# EAGLE design Logic Module - Power V8 (EAGLE 9.3.1)
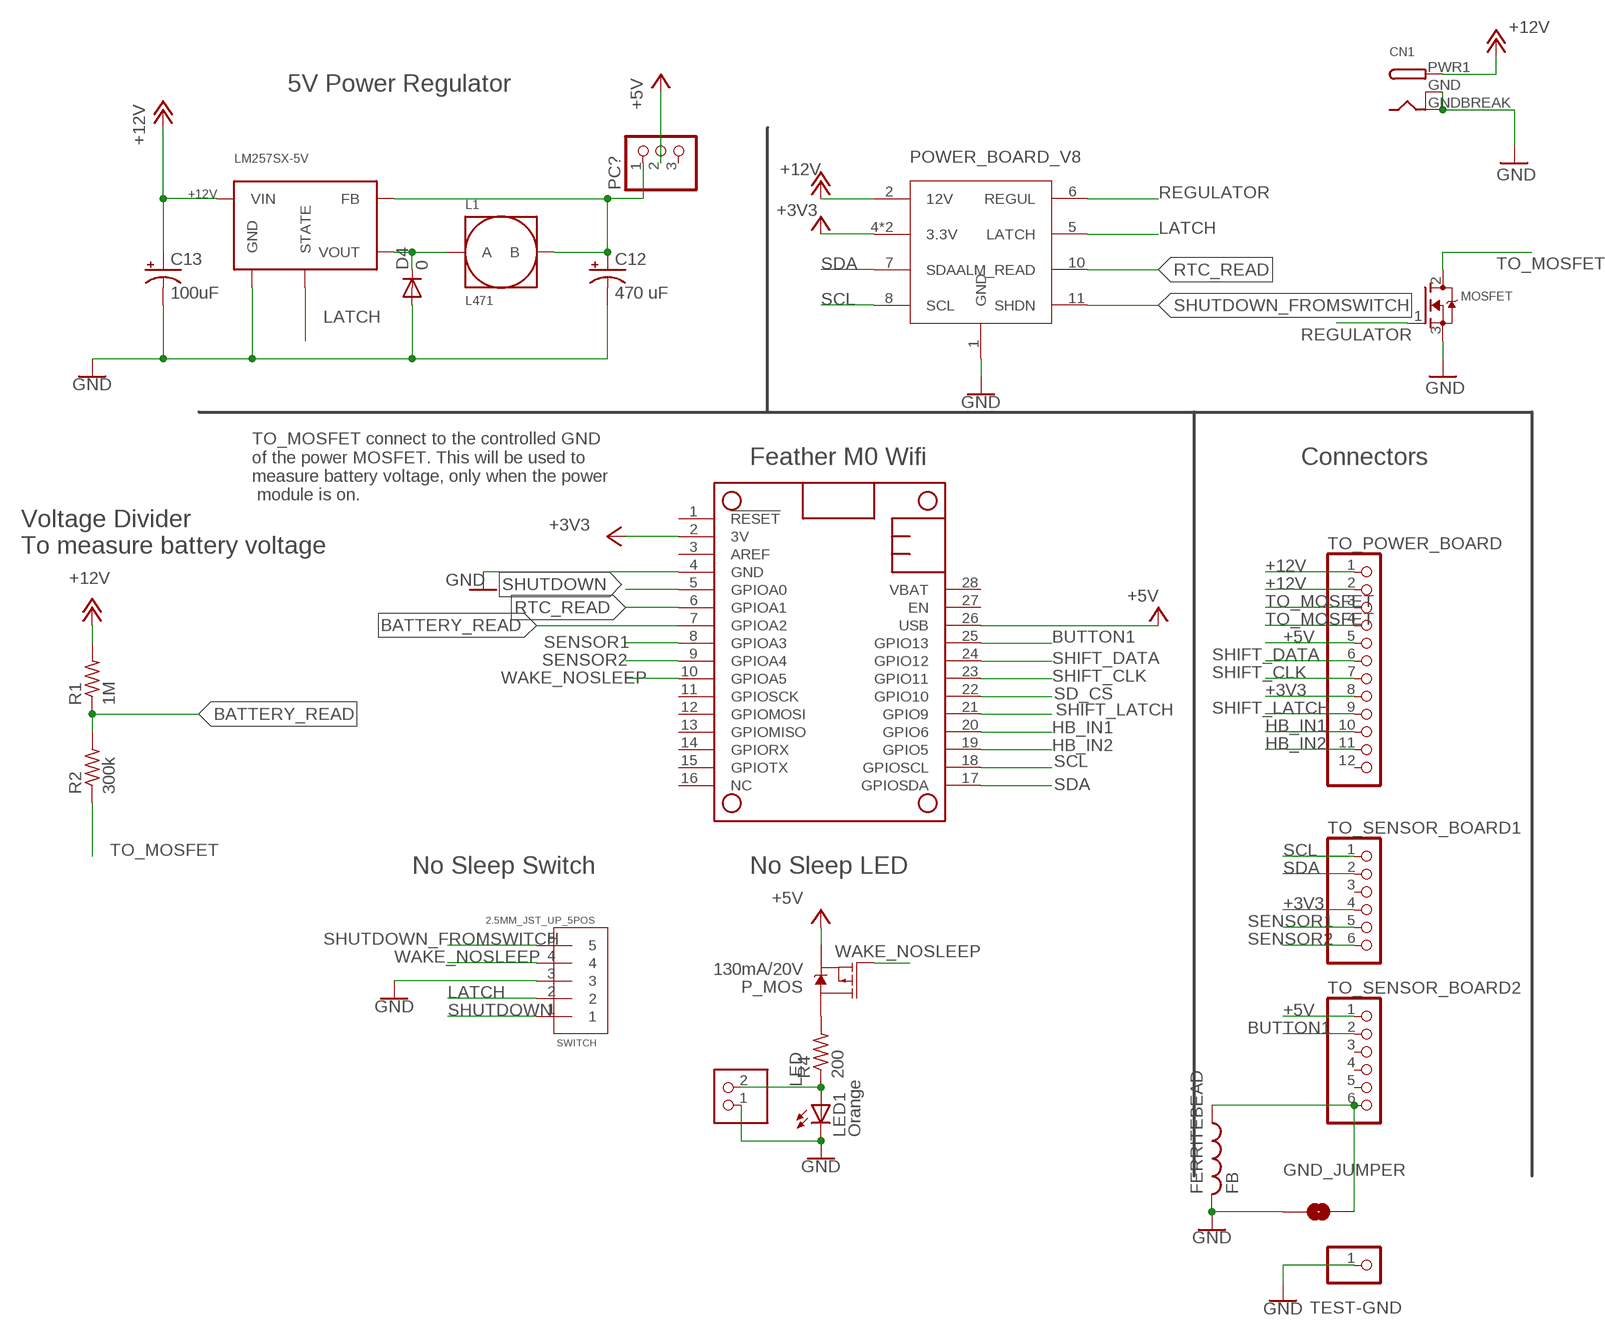
[diagram p0: schematic, sheet 1]

## Parts
C12  470 uF  CPOL-US153CLV-0810  [153CLV-0810]
C13  100uF  CPOL-US153CLV-0605  [153CLV-0605]
CN1  DCBARRELSMT  [DCJACK_2MM_SMT]
D4  0  1N4004  [DO41-10]
FERRITEBEAD  FB  [FB]
GND_JUMPER  JUMPER-SMT_2_NO_NO-SILK  [SMT-JUMPER_2_NO_NO-SILK]
L1  L471  [12-12]
LED  2.5MM_JST_UP_2POS  [JST_2POS_2.5MM_UP]
LED1  Orange  LED3MM  [LED3MM]
LM257SX-5V  LM2575  [TO-263]
MOSFET  MOSFET-NGDS_TO220V  [TO220V]
MS1  FEATHERWING  [FEATHERWING]
P_MOS  130mA/20V  MOSFET_PCH-IRLML2244  [SOT23-3]
PC?  PINHD-1X3  [1X03]
POWER_BOARD_V8  OPENS_POWER_8  [OPEN_POWER_8]
R1  1M  R-US_R1206  [R1206]
R2  300k  R-US_R1206  [R1206]
R4  200  R-US_0204/7  [0204/7]
SWITCH  2.5MM_JST_UP_5POS  [JST_5POS_2.5MM_UP]
TEST-GND  PINHD-1X1  [1X01]
TO_POWER_BOARD  PINHD-1X12  [1X12]
TO_SENSOR_BOARD1  PINHD-1X6CB  [1X06-CLEANBIG]
TO_SENSOR_BOARD2  PINHD-1X6CB  [1X06-CLEANBIG]

## Nets
5_RAW [5v]: C12.+ L1.B LM257SX-5V.FB PC?.1
+3V3: MS1.2(3V) POWER_BOARD_V8.4(3.3V) POWER_BOARD_V8.9(3.3V) TO_POWER_BOARD.8 TO_SENSOR_BOARD1.4
+5V [12v]: MS1.26(USB) P_MOS.2(S) PC?.2 TO_POWER_BOARD.5 TO_SENSOR_BOARD2.1
+12V [12v]: C13.+ CN1.PWR1(PWR) LM257SX-5V.VIN POWER_BOARD_V8.2(12V) R1.2 TO_POWER_BOARD.1 TO_POWER_BOARD.2
BATTERY_READ: MS1.7(GPIOA2) R1.1 R2.2
BUTTON1: MS1.25(GPIO13) TO_SENSOR_BOARD2.2
GND: C12.- C13.- CN1.GND(GNDBREAK) CN1.GNDBREAK(GND) D4.A FERRITEBEAD.P$2 GND_JUMPER.1 LED1.K(C) LED.1 LM257SX-5V.GND MOSFET.3(S) MS1.4(GND) POWER_BOARD_V8.1(GND) SWITCH.3 TEST-GND.1
HB_IN1: MS1.20(GPIO6) TO_POWER_BOARD.10
HB_IN2: MS1.19(GPIO5) TO_POWER_BOARD.11
LATCH: LM257SX-5V.STATE POWER_BOARD_V8.5(LATCH) SWITCH.2
N$2: P_MOS.3(D) R4.2
N$3: LED1.A LED.2 R4.1
N$6: FERRITEBEAD.P$1 GND_JUMPER.2 TO_SENSOR_BOARD2.6
N$8 [5v]: D4.C L1.A LM257SX-5V.VOUT
REGULATOR: MOSFET.1(G) POWER_BOARD_V8.6(REGUL)
RTC_READ: MS1.6(GPIOA1) POWER_BOARD_V8.10(ALM_READ)
SCL: MS1.18(GPIOSCL) POWER_BOARD_V8.8(SCL) TO_SENSOR_BOARD1.1
SD_CS: MS1.22(GPIO10)
SDA: MS1.17(GPIOSDA) POWER_BOARD_V8.7(SDA) TO_SENSOR_BOARD1.2
SENSOR1: MS1.8(GPIOA3) TO_SENSOR_BOARD1.5
SENSOR2: MS1.9(GPIOA4) TO_SENSOR_BOARD1.6
SHIFT_CLK: MS1.23(GPIO11) TO_POWER_BOARD.7
SHIFT_DATA: MS1.24(GPIO12) TO_POWER_BOARD.6
SHIFT_LATCH: MS1.21(GPIO9) TO_POWER_BOARD.9
SHUTDOWN: MS1.5(GPIOA0) SWITCH.1
SHUTDOWN_FROMSWITCH: POWER_BOARD_V8.11(SHDN) SWITCH.5
TO_MOSFET: MOSFET.2(D) R2.1 TO_POWER_BOARD.3 TO_POWER_BOARD.4
WAKE_NOSLEEP: MS1.10(GPIOA5) P_MOS.1(G) SWITCH.4
Unconnected: MS1.1(!RESET) MS1.3(AREF) MS1.11(GPIOSCK) MS1.12(GPIOMOSI) MS1.13(GPIOMISO) MS1.14(GPIORX) MS1.15(GPIOTX) MS1.16(NC) MS1.27(EN) MS1.28(VBAT) PC?.3 TO_POWER_BOARD.12 TO_SENSOR_BOARD1.3 TO_SENSOR_BOARD2.3 TO_SENSOR_BOARD2.4 TO_SENSOR_BOARD2.5

## Notes on the sheet
- 5V Power Regulator
- Feather M0 Wifi | Connectors
- TO_MOSFET connect to the controlled GND 
  of the power MOSFET. This will be used to
  measure battery voltage, only when the power
   module is on.
- Voltage Divider
  To measure battery voltage
- No Sleep Switch | No Sleep LED

## Library data of the parts
C12 C13 = rcl:CPOL-US: POLARIZED CAPACITOR, American symbol; SPICEPREFIX: C
CN1 = adafruit:DCBARREL: 2.0mm DC Barrel Jack DCJACK_2MM_PTH - Through Hole Jack (4UConnector: 05537)
D4 = adafruit:1N4004: DIODE General purpose 1N400x type rectifier (With bigger pads) http://www.ladyada.net/library/pcb/eaglelibrary.html
FERRITEBEAD = adafruit:FB: Ferrite bead Digikey #P9821BK-ND
GND_JUMPER = SparkFun-Jumpers:JUMPER-SMT_2_NO: Normally open jumper This jumper has two pads in close proximity to each other. Apply solder to close the connection. Round pads are easier to solder for beginners, but are a lot larger. SparkFun Product that uses the round pads: SparkFun EL Sequencer <https://www.sparkfun.com/products/12781>
L1 = LM2575:L471
LED = eDNA:2.5MM_JST_UP_2POS
LED1 = adafruit:LED: LED OSRAM: - CHIPLED LG R971, LG N971, LY N971, LG Q971, LY Q971, LO R971, LY R971 LH N974, LH R974 LS Q976, LO Q976, LY Q976 LO Q996 - Hyper CHIPLED LW Q18S LB Q993, LB Q99A, LB R99A - SideLED LS A670, LO A670, LY A670, LG A670, LP A670 LB A673, LV A673, LT A673, LW A673 LH A674 LY A675 LS A676, LA A676, LO A676, LY A676, LW A676 LS A679, LY A679, LG A679 - Hyper Micro SIDELED® LS Y876, LA Y876, LO Y876, LY Y876 LT Y87S - SmartLED LW L88C, LW L88S LB L89C, LB L89S, LG L890 LS L89K, LO L89K, LY L89K LS L896, LA L896, LO L896, LY L896 - TOPLED LS T670, LO T670, LY T670, LG T670, LP T670 LSG T670, LSP T670, LSY T670, LOP T670, LYG T670 LG T671, LOG T671, LSG T671 LB T673, LV T673, LT T673, LW T673 LH T674 LS T676, LA T676, LO T676, LY T676, LB T676, LH T676, LSB T676, LW T676 LB T67C, LV T67C, LT T67C, LS T67K, LO T67K, LY T67K, LW E67C LS E67B, LA E67B, LO E67B, LY E67B, LB E67C, LV E67C, LT E67C LW T67C LS T679, LY T679, LG T679 LS T770, LO T770, LY T770, LG T770, LP T770 LB T773, LV T773, LT T773, LW T773 LH T774 LS E675, LA E675, LY E675, LS T675 LS T776, LA T776, LO T776, LY T776, LB T776 LHGB T686 LT T68C, LB T68C - Hyper Mini TOPLED® LB M676 - Mini TOPLED Santana® LG M470 LS M47K, LO M47K, LY M47K Source: http://www.osram.convergy.de/
LM257SX-5V = LM2575:LM2575
MOSFET = adafruit:MOSFET-N: N-Channel Mosfet 2N7002E - 60V 260mA SOT23 [Digikey: 2N7002ET1GOSTR-ND] - REEL BSH103 - 30V 850mA SOT23 [Digikey: 568-5013-1-ND]
MS1 = adafruit:FEATHERWING
P_MOS = SparkFun-DiscreteSemi:MOSFET_PCH: P-channel MOSFETs Voltage controlled devices that allow control of high current outputs. SparkFun Products: SparkFun ESP32 Thing <https://www.sparkfun.com/products/13907> SparkFun ESP8266 Thing <https://www.sparkfun.com/products/13231>; PROD_ID: TRANS-11153; VALUE: 4.3A/20V/54mΩ
PC? = pinhead:PINHD-1X3: PIN HEADER
POWER_BOARD_V8 = eDNA:OPENS_POWER_8
R1 R2 R4 = adafruit:R-US_: RESISTOR, American symbol
SWITCH = eDNA:2.5MM_JST_UP_5POS: 2.5MM JST 5POS, 5 Position, up https://www.digikey.com/product-detail/en/jst-sales-america-inc/B5B-XH-A-LF-SN/455-2270-ND/1530483
TEST-GND = adafruit:PINHD-1X1: Pin header 1x1 for 0.1" spacing With round pins
TO_POWER_BOARD = adafruit:PINHD-1X12: PIN HEADER
TO_SENSOR_BOARD1 TO_SENSOR_BOARD2 = adafruit:PINHD-1X6: PIN HEADER

## Net classes
0 default: clearance 0.2 mm
1 12v: width 0.61 mm, clearance 0.356 mm
2 5v: width 0.406 mm, clearance 0.305 mm
3 sig: width 0.152 mm, clearance 0.152 mm

## Board
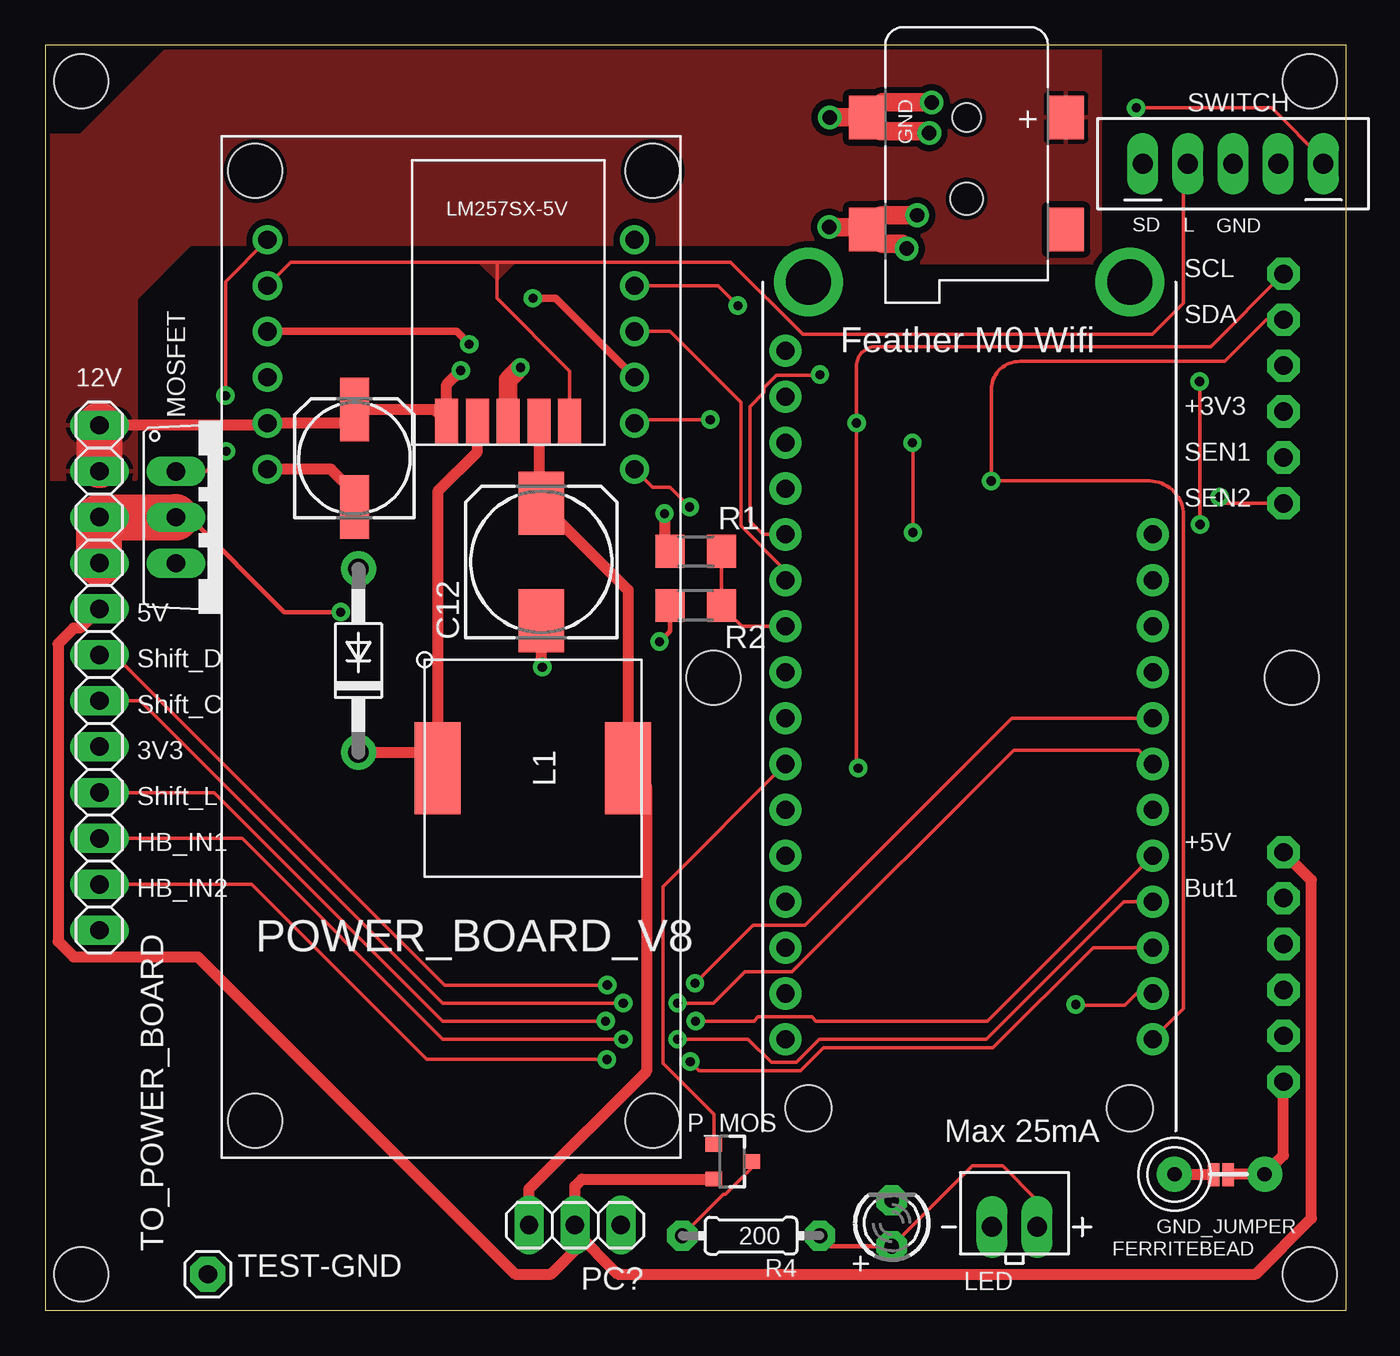
[diagram p1: board, top side]
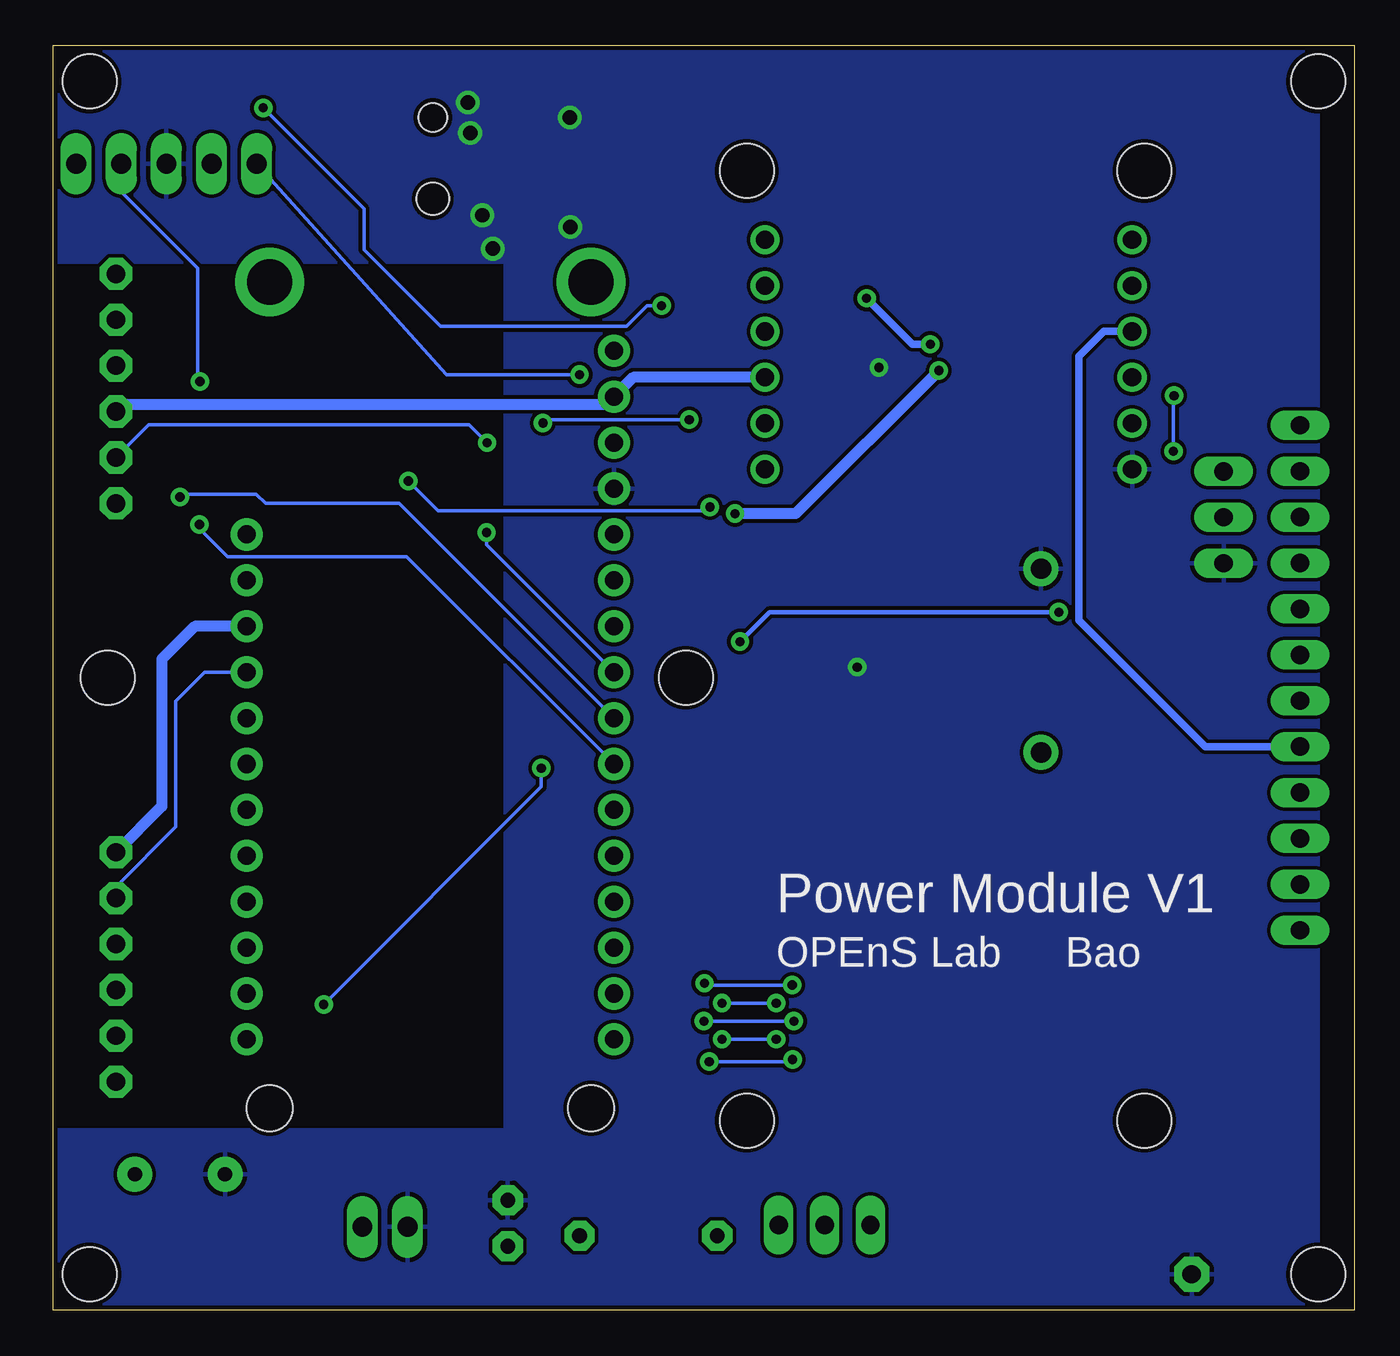
[diagram p2: board, bottom side, seen from below]

Size 72 x 70 mm. Coordinates in mm from the lower left corner, seen from the top.
Outline: 0,0 72,0 72,70 0,70 0,0
Copper layers (1*16): Top 0.035mm / dielectric 1.5mm / Bottom 0.035mm
Design rules "SparkFun": minimum track width 8mil, minimum drill 20mil, track to track 8mil, track to pad 8mil, pad to pad 8mil, via to via 8mil, smd to smd 8mil, copper to edge 10mil, drill to drill 8mil, minimum pad ring 12mil, minimum via ring 10mil, stop-mask expansion 4mil, vias tented up to drill 25mil, thermal gap 10mil
Holes 3 mm at 37,35 69,35 2,68 2,2 70,68 70,2

### Footprints (pad centres in the part's own frame; a part is rotated, then mirrored left to right if it is on the bottom)
153CLV-0810 = smd 3.5 x 2.5: + 3.25,0; - -3.25,0
153CLV-0605 = smd 3.5 x 1.6: + 2.7,0; - -2.7,0
DCJACK_2MM_SMT = smd 2.4 x 2: GND 0,-5.5; GNDBREAK 6.2,-5.5; PWR1 0,5.5; PWR2 6.2,5.5 | hole 1.6: 0,0 | hole 1.8: 4.5,0
DO41-10 = drill 1.118 pad 1.93: A 5.08,0; C -5.08,0
FB = drill 0.8 pad 1.93: P$1 -2.5,0; P$2 2.5,0
SMT-JUMPER_2_NO_NO-SILK = smd 0.635 x 1.27: 1 -0.406,0; 2 0.406,0
12-12 = smd 5.08 x 2.54: A 0,-5.27; B 0,5.27
JST_2POS_2.5MM_UP = drill 1.1 long: 1 -1.25,0; 2 1.25,0
LED3MM = drill 0.813 pad 1.676 octagon: A -1.27,0; K 1.27,0
TO-263 = smd 1.27 x 2.54: FB 1.702,1.016; GND 0,1.016; STATE 3.404,1.016; VIN -3.404,1.016; VOUT -1.702,1.016
TO220V = drill 1.016 long: 1 -2.54,-2.54; 2 0,-2.54; 3 2.54,-2.54
FEATHERWING = drill 1 pad 1.778: 1 6.35,1.27; 2 8.89,1.27; 3 11.43,1.27; 4 13.97,1.27; 5 16.51,1.27; 6 19.05,1.27; 7 21.59,1.27; 8 24.13,1.27; 9 26.67,1.27; 10 29.21,1.27; 11 31.75,1.27; 12 34.29,1.27; 13 36.83,1.27; 14 39.37,1.27; 15 41.91,1.27; 16 44.45,1.27; 17 44.45,21.59; 18 41.91,21.59; 19 39.37,21.59; 20 36.83,21.59; 21 34.29,21.59; 22 31.75,21.59; 23 29.21,21.59; 24 26.67,21.59; 25 24.13,21.59; 26 21.59,21.59; 27 19.05,21.59; 28 16.51,21.59 | drill 2.5 pad 3.81: P$1 2.54,20.32; P$2 2.54,2.54 | hole 2.54: 48.26,20.32; 48.26,2.54
SOT23-3 = smd 0.8 x 0.9: 1 -0.95,-1; 2 0.95,-1; 3 0,1.1
1X03 = drill 1.016 long: 1 -2.54,0; 2 0,0; 3 2.54,0
OPEN_POWER_8 = drill 1: 1 2.54,12.7; 2 5.08,12.7; 3 7.62,12.7; 4 10.16,12.7; 5 12.7,12.7; 6 15.24,12.7; 7 2.54,-7.62; 8 5.08,-7.62; 9 7.62,-7.62; 10 10.16,-7.62; 11 12.7,-7.62; 12 15.24,-7.62 | hole 3: 19.05,13.38; 19.05,-8.62; -33.5,-8.62; -33.5,13.38
R1206 = smd 1.6 x 1.803: 1 -1.422,0; 2 1.422,0
0204/7 = drill 0.813 pad 1.676 octagon: 1 -3.81,0; 2 3.81,0
JST_5POS_2.5MM_UP = drill 1.1 long: 1 -5,0; 2 -2.5,0; 3 0,0; 4 2.5,0; 5 5,0
1X01 = drill 1.016 pad 1.93 octagon: 1 0,0
1X12 = drill 1.016 long: 1 -13.97,0; 2 -11.43,0; 3 -8.89,0; 4 -6.35,0; 5 -3.81,0; 6 -1.27,0; 7 1.27,0; 8 3.81,0; 9 6.35,0; 10 8.89,0; 11 11.43,0; 12 13.97,0
1X06-CLEANBIG = drill 1.016 pad 1.778 octagon: 1 -6.35,0; 2 -3.81,0; 3 -1.27,0; 4 1.27,0; 5 3.81,0; 6 6.35,0

### Placement (x,y rotation side)
C12  27.46,41.41 90 top
C13  17.12,47.15 90 top
CN1  51,66 270 top
D4  17.34,35.95 90 top
FERRITEBEAD  65,7.53 180 top
GND_JUMPER  65.07,7.5 0 top
L1  27,30 270 top
LED  53.65,4.62 0 top
LED1  46.86,4.82 90 top
LM257SX-5V  25.63,48.14 0 top
MOSFET  9.77,43.88 270 top
MS1  39.71,59.44 270 top
P_MOS  38.01,8.23 270 top
PC?  29.32,4.72 0 top
POWER_BOARD_V8  25,44 90 top
R1  36,42 180 top
R2  36,39 0 top
R4  39.07,4.13 180 top
SWITCH  65.75,63.44 0 top
TEST-GND  9,2 0 top
TO_POWER_BOARD  3,35 270 top
TO_SENSOR_BOARD1  68.54,51 270 top
TO_SENSOR_BOARD2  68.54,19 270 top

### Tracks (layer width: path | path; a pad name or v marks a point on that pad's centre or on a via)
5_RAW
  Top 0.61: LM257SX-5V.FB 27.33,44.79 C12.+ 32.27,39.85 L1.B 33.27,29 33.27,13.21 26.78,6.72 PC?.1
+3V3  (via drill 0.51)
  Top 0.406: POWER_BOARD_V8.4 22.76,54.16 v23.47,53.45 | v27,56 28.24,56 POWER_BOARD_V8.9
  Bottom 0.406: TO_POWER_BOARD.8 8.25,31.19 15.24,38.18 15.24,52.79 13.87,54.16 POWER_BOARD_V8.4 | v27,56 24.45,53.45 v23.47,53.45
  Bottom 0.61: POWER_BOARD_V8.9 39.91,51.62 MS1.2 41.39,50.14 68.13,50.14 TO_SENSOR_BOARD1.4
+5V
  Top 0.61: TO_POWER_BOARD.5 1.93,37.74 1.58,37.74 0.71,36.88 0.71,20.42 1.58,19.56 8.44,19.56 26,2 28,2 29.32,3.32 PC?.2 | PC?.2 29.32,4.36 31.68,2 67,2 70.09,5.09 70.09,23.8 TO_SENSOR_BOARD2.1 | PC?.2 29.32,6.87 29.71,7.26 36.99,7.26 P_MOS.2
  Bottom 0.61: MS1.26 64.18,37.85 66,36.03 66,27.89 TO_SENSOR_BOARD2.1
+12V  (via drill 0.51)
  Top 0.61: TO_POWER_BOARD.1 12.19,48.97 POWER_BOARD_V8.2 16.85,49.08 C13.+ 21.53,49.85 LM257SX-5V.VIN 22.23,51.23 v23,52 | v34.28,44.08 34.28,42.3 R1.2
  Top 2.54: TO_POWER_BOARD.1 3,46.79
  Bottom 0.61: v23,52 30.92,44.08 v34.28,44.08
  pour Top: 0,65 2,65 7,70 58.37,70 58.37,58 45,58 44,59 8,59 5,56 5,46 0,46
BATTERY_READ
  Top 0.203: R1.1 R2.2 38.57,37.85 MS1.7
BUTTON1
  Bottom 0.203: TO_SENSOR_BOARD2.2 68.54,23.45 65.24,26.75 65.24,33.7 63.63,35.31 MS1.25
GND  (via drill 0.51, 0.8)
  Top 0.61: v27.52,35.59 27.46,35.65 C12.- | C13.- 17.12,45.23 15.81,46.54 POWER_BOARD_V8.1 | GND_JUMPER.1 64.63,7.53 FERRITEBEAD.P$2
  Top 1.016: v26.31,52.17 25.63,51.49 LM257SX-5V.GND | v48.94,65.14 48.85,65.23 46.27,65.23 CN1.GND | CN1.GND 46.33,66.83 v49.07,66.83 | CN1.GND v43.44,66 v43.43,65.99 | CN1.GNDBREAK 44.92,59.8 44.78,59.94 v43.39,59.94 | CN1.GNDBREAK 46.29,60.59 v48.27,60.59 | v47.68,58.74 47.42,59 46.3,59 CN1.GNDBREAK
  pour Bottom: 2,70 2,0 72,0 72,10 47,10 47,58 72,58 72,70
HB_IN1  (via drill 0.51)
  Top 0.203: TO_POWER_BOARD.10 10.89,26.11 22,15 v32,15 | v35,15 38.91,15 40.2,13.72 41.57,13.72 42.86,15 52.1,15 59.71,22.61 MS1.20
  Bottom 0.203: v32,15 v35,15
HB_IN2  (via drill 0.51)
  Top 0.203: TO_POWER_BOARD.11 11.43,23.57 21.12,13.88 v31.09,13.88 | v35.7,13.76 36.2,13.26 41.81,13.26 43.08,14.52 52.46,14.52 58.01,20.07 MS1.19
  Bottom 0.203: v35.7,13.76 31.21,13.76 v31.09,13.88
LATCH
  Top 0.203: 25,58 13.6,58 POWER_BOARD_V8.5 | LM257SX-5V.STATE 29.03,51.97 25,56 25,58 | 25,58 37.94,58 41.94,54 61.27,54 63,55.73 63,63.19 SWITCH.2
  pour Top: 24,58 25,57 26,58
N$2
  Top 0.203: R4.2 37.55,6.42 37.65,6.42 39.11,7.88 P_MOS.3
N$3
  Top 0.203: LED1.A 51.31,8 53,8 54.9,6.1 LED.2
  Top 0.254: R4.1 43.46,3.55 LED1.A
N$6
  Top 0.61: TO_SENSOR_BOARD2.6 68.54,8.57 FERRITEBEAD.P$1 65.51,7.53 GND_JUMPER.2
N$8
  Top 0.61: LM257SX-5V.VOUT 23.89,49.12 23.89,47.47 21.73,45.31 L1.A 21.73,30.87 D4.C
REGULATOR  (via drill 0.51)
  Top 0.203: MOSFET.1 8.9,46.42 v10.01,47.53 | v9.98,50.61 9.98,56.92 POWER_BOARD_V8.6
  Bottom 0.203: v9.98,50.61 10.01,50.58 v10.01,47.53
RTC_READ
  Top 0.203: POWER_BOARD_V8.10 34.59,54.16 38.5,50.25 38.5,43.41 40.98,40.93 MS1.6
SCL  (via drill 0.51)
  Top 0.203: v36.81,49.28 32.82,49.28 POWER_BOARD_V8.8 | TO_SENSOR_BOARD1.1 64.51,53.32 45.98,53.32 arc90 44.91,52.25 v44.91,49.1 44.91,30.09 v45,30 | MS1.18 60.39,17.53 59.75,16.89 57.07,16.89 v57.04,16.92
  Bottom 0.203: v44.91,49.1 44.73,49.28 v36.81,49.28 | v57.04,16.92 45,28.96 v45,30
SDA  (via drill 0.51)
  Top 0.203: POWER_BOARD_V8.7 33.62,45.54 34.58,45.54 v35.67,44.45 | TO_SENSOR_BOARD1.2 67.59,54.81 65.28,52.5 53.94,52.5 arc90 52.36,50.92 v52.36,45.89 61.11,45.89 arc-90 63,44 63,16.69 MS1.17
  Bottom 0.203: v52.36,45.89 50.71,44.24 35.88,44.24 v35.67,44.45
SENSOR1  (via drill 0.51)
  Top 0.203: v48,48 48.03,47.97 v48.03,43.04
  Bottom 0.203: MS1.8 48.03,42.36 v48.03,43.04 | v48,48 49,49 66.73,49 TO_SENSOR_BOARD1.5
SENSOR2  (via drill 0.51)
  Top 0.203: v65,45 65.35,44.65 TO_SENSOR_BOARD1.6
  Bottom 0.203: MS1.9 52.86,44.65 60.26,44.65 60.78,45.16 64.84,45.16 v65,45
SHIFT_CLK  (via drill 0.51)
  Top 0.203: TO_POWER_BOARD.7 5.27,33.73 22,17 v32,17 | v35,17 37,17 38.73,18.73 41.34,18.73 53.61,31 60.53,31 MS1.23
  Bottom 0.203: v32,17 v35,17
SHIFT_DATA  (via drill 0.51)
  Top 0.203: TO_POWER_BOARD.6 3.83,36.27 22.11,17.99 v31.1,17.99 v31.11,18 | MS1.24 53.51,32.77 42.04,21.31 39.18,21.31 v35.97,18.1
  Bottom 0.203: v35.97,18.1 35.87,18 v31.11,18
SHIFT_LATCH  (via drill 0.51)
  Top 0.203: TO_POWER_BOARD.9 9.35,28.65 22,16 v31.02,16 | MS1.21 52.15,16 42.67,16 42.43,16.23 39.47,16.23 39.23,16 v36,16
  Bottom 0.203: v31.02,16 v36,16
SHUTDOWN  (via drill 0.51)
  Top 0.203: MS1.5 39.73,42.93 39,43.66 39,50 39.79,50.79 39.79,51.04 40.49,51.74 42.85,51.74 v42.88,51.77
  Bottom 0.203: v42.88,51.77 50.25,51.77 SWITCH.1
SHUTDOWN_FROMSWITCH  (via drill 0.51)
  Top 0.203: POWER_BOARD_V8.11 37.23,56.7 v38.34,55.59 | SWITCH.5 70.75,63.67 67.89,66.53 v60.39,66.53
  Bottom 0.203: v38.34,55.59 39.14,55.59 40.27,54.46 50.58,54.46 54.81,58.69 54.81,60.95 v60.39,66.53
TO_MOSFET  (via drill 0.51)
  Top 0.254: MOSFET.2 7.99,43.88 13.24,38.63 v16.36,38.63 | v34,37 34.58,37.58 R2.1
  Top 2.54: TO_POWER_BOARD.4 TO_POWER_BOARD.3 MOSFET.2
  Bottom 0.254: v16.36,38.63 32.37,38.63 v34,37
WAKE_NOSLEEP  (via drill 0.51)
  Top 0.203: P_MOS.1 37.01,10.84 34.19,13.66 34.19,23.44 MS1.10 | v63.89,51.39 63.92,51.36 v63.92,43.48
  Bottom 0.203: MS1.10 52.45,41.7 62.37,41.7 63.92,43.25 v63.92,43.48 | v63.89,51.39 64.02,51.52 64.02,57.67 68.25,61.9 SWITCH.4

### Text on the board
tPlace: SD | L | GND | SCL | SDA | Feather M0 Wifi | 12V | +3V3 | SEN1 | SEN2 | 5V | Shift_D | Shift_C | 3V3 | Shift_L | HB_IN1 | +5V | HB_IN2 | But1 | Max 25mA
bPlace: Power Module V1 | Bao | OPEnS Lab